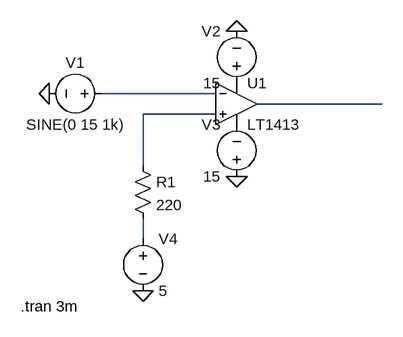
[diagram p0: schematic comparatorinv.asc]
comparatorinv.asc, the LTspice schematic file:
Version 4
SHEET 1 880 680
WIRE 256 128 80 128
WIRE 512 144 320 144
WIRE 256 160 144 160
WIRE 144 240 144 160
WIRE 144 352 144 320
FLAG 288 32 0
FLAG 288 256 0
FLAG 144 432 0
FLAG 0 128 0
SYMBOL OpAmps\\LT1413 288 80 R0
SYMATTR InstName U1
SYMBOL voltage 96 128 R90
WINDOW 0 -32 56 VBottom 2
WINDOW 3 32 56 VTop 2
WINDOW 123 0 0 Left 0
WINDOW 39 0 0 Left 0
SYMATTR InstName V1
SYMATTR Value SINE(0 15 1k)
SYMBOL voltage 288 128 R180
WINDOW 0 24 96 Left 2
WINDOW 3 24 16 Left 2
WINDOW 123 0 0 Left 0
WINDOW 39 0 0 Left 0
SYMATTR InstName V2
SYMATTR Value 15
SYMBOL voltage 288 272 R180
WINDOW 0 24 96 Left 2
WINDOW 3 24 16 Left 2
WINDOW 123 0 0 Left 0
WINDOW 39 0 0 Left 0
SYMATTR InstName V3
SYMATTR Value 15
SYMBOL voltage 144 336 R0
WINDOW 123 0 0 Left 0
WINDOW 39 0 0 Left 0
SYMATTR InstName V4
SYMATTR Value 5
SYMBOL res 128 224 R0
SYMATTR InstName R1
SYMATTR Value 220
TEXT -44 456 Left 2 !.tran 3m

The netlist it stands for:
* comparatorinv.asc
XU1 N003 N001 P001 P002 N002 LT1413  ; pins In+ In- V+ V- OUT
V1 N001 0 SINE(0 15 1k)
V2 P001 0 15
V3 0 P002 15
V4 N004 0 5
R1 N003 N004 220
.tran 3m
.lib LTC.lib
.backanno
.end